# Altium schematic sheet 02_MCU_LCD.SchDoc
size A3; SheetNumber: 2; SheetTotal: 16
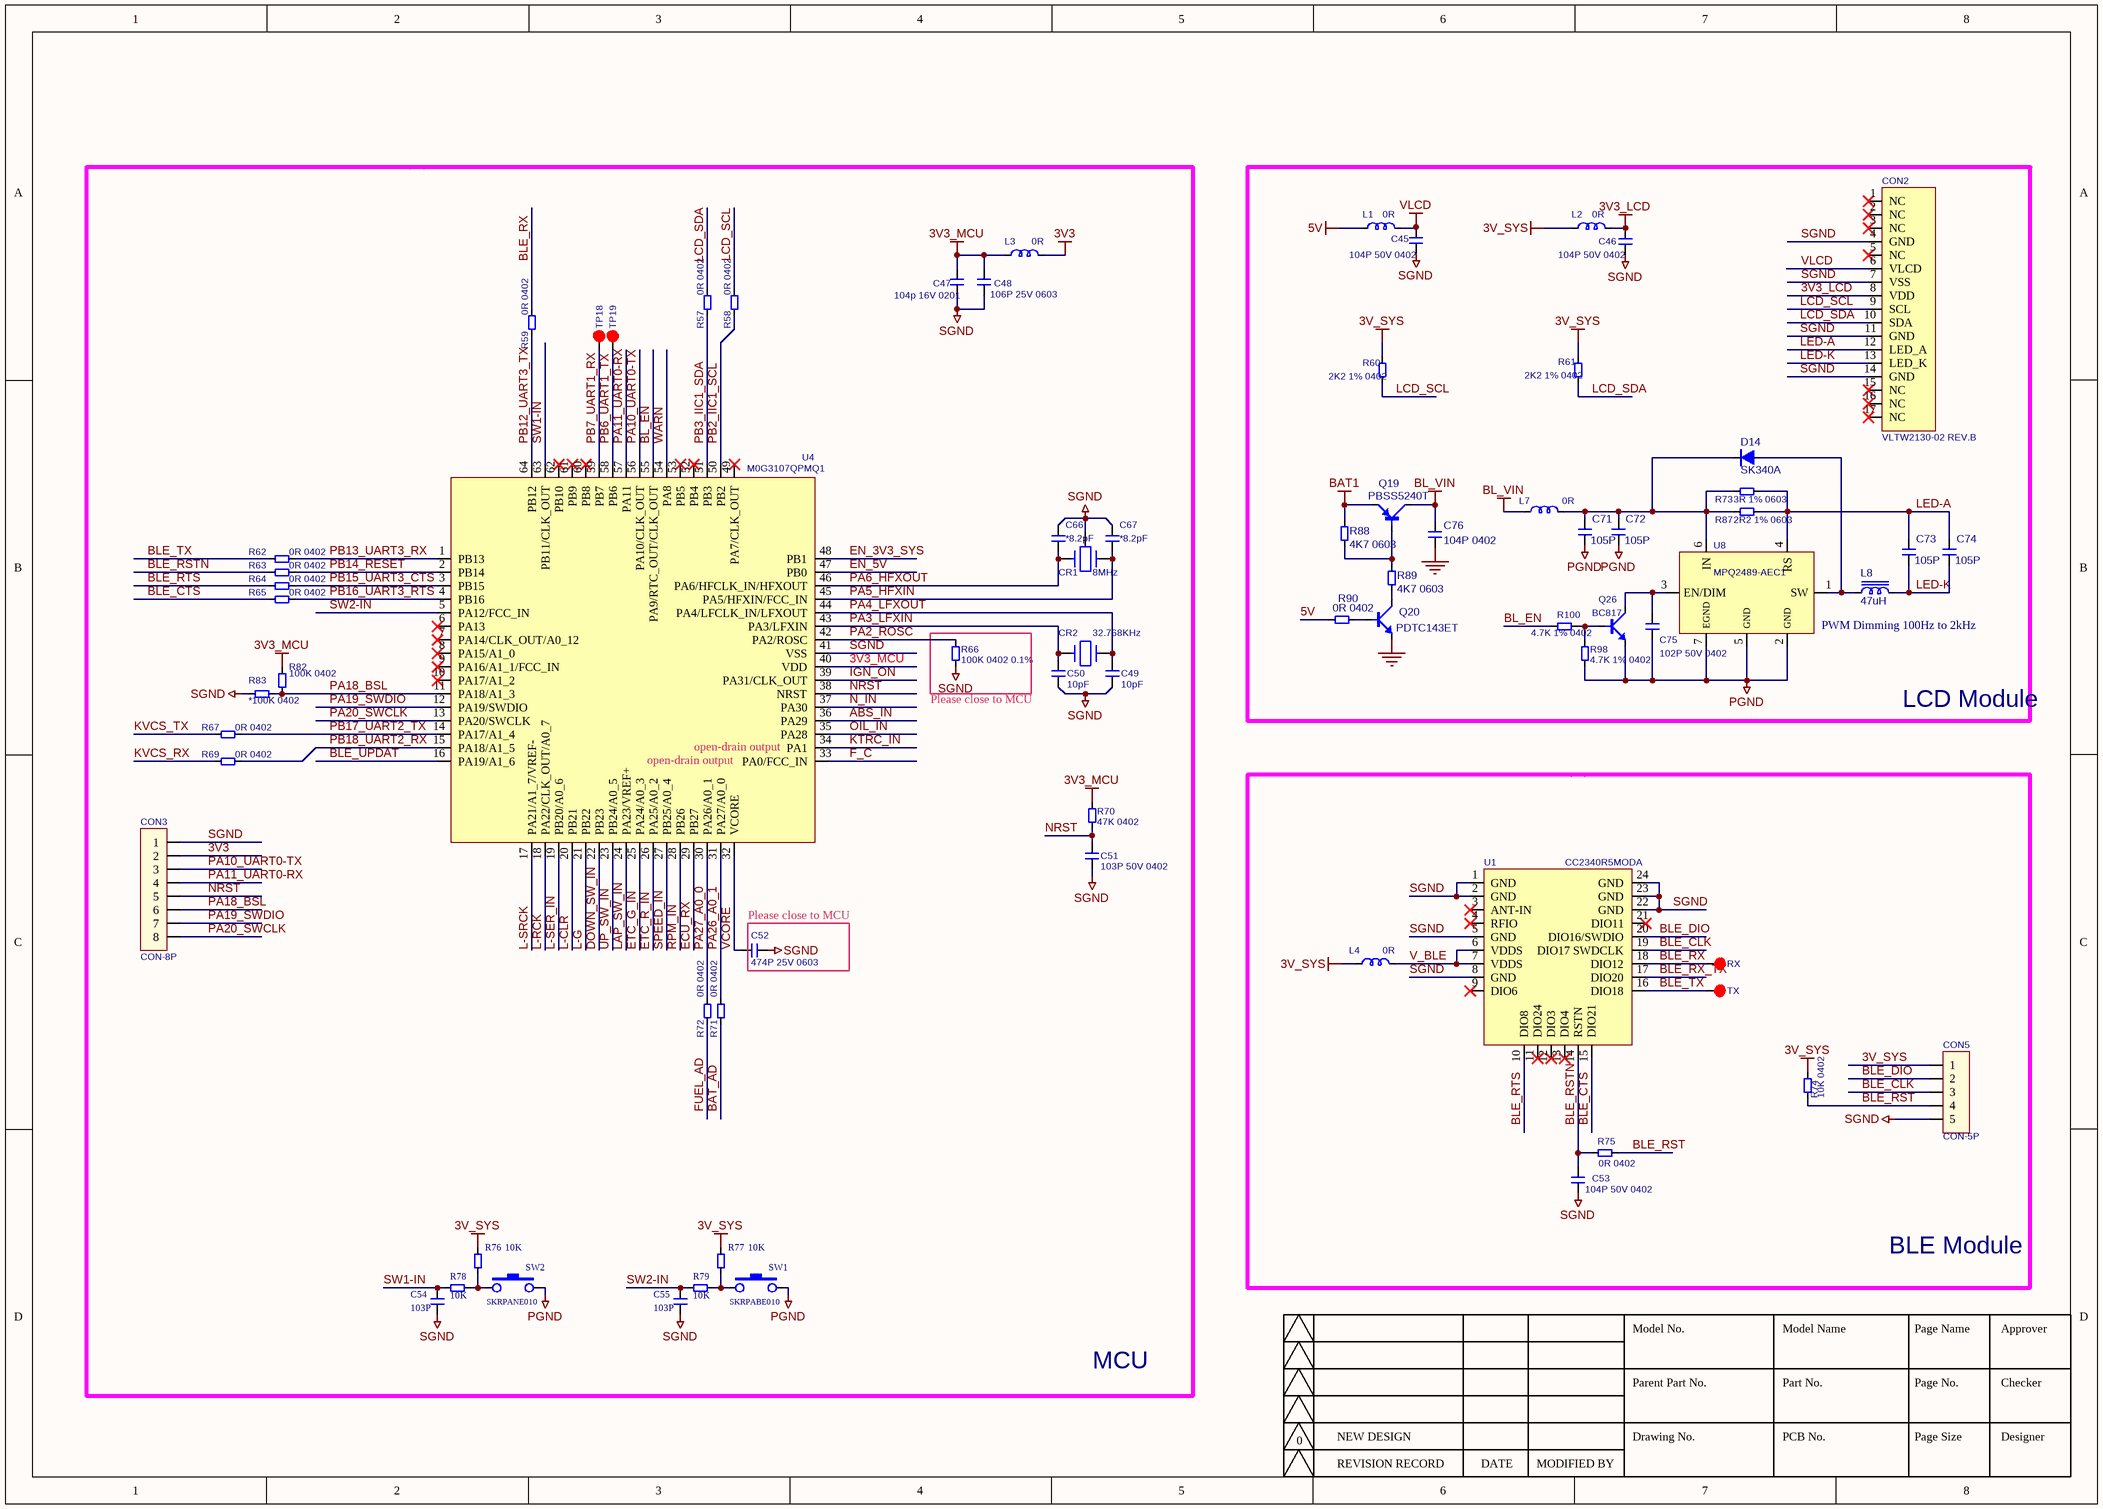
[diagram p0: 02_MCU_LCD.SchDoc]

## Parts
C45  104P 50V 0402  [C0402]
C46  104P 50V 0402  [C0402]
C47  104p 16V 0201  [C0201]
C48  106P 25V 0603  [C0603]
C49  10pF  [C0402]
C50  10pF  [C0402]
C51  103P 50V 0402  [C0402]
C52  474P 25V 0603  [C0603]
C53  104P 50V 0402  [C0402]
C54  103P  [C0402]
C55  103P  [C0402]
C66  *8.2pF  [C0402]
C67  *8.2pF  [C0402]
C71  105P  [C0603]
C72  105P  [C0603]
C73  105P  [C0603]
C74  105P  [C0603]
C75  102P 50V 0402  [C0402]
C76  104P 0402  [c0402]
CON2  VLTW2130-02 REV.B  [FPC-BL112-17P]
CON3  CON-8P  [CON-2.0(9021-N)-8P]
CON5  CON-5P  [CON-2.0V-5P]
CR1  8MHz  [CR-3CE]
CR2  32.768KHz  [CR-FC-13A]
D14  SK340A  [D-SMA]
L1  0R  [0603]
L2  0R  [0603]
L3  0R  [0603]
L4  0R  [0603]
L7  0R  [0603]
L8  47uH  [L-7.4X6.8]
Q19  PBSS5240T  [SOT23-RF]
Q20  PDTC143ET  [SOT23-RF]
Q26  BC817  [SOT323]
R57  0R 0402  [0402]
R58  0R 0402  [0402]
R59  0R 0402  [0402]
R60  2K2 1% 0402  [0402]
R61  2K2 1% 0402  [0402]
R62  0R 0402  [0402]
R63  0R 0402  [0402]
R64  0R 0402  [0402]
R65  0R 0402  [0402]
R66  100K 0402 0.1%  [0402]
R67  0R 0402  [0402]
R69  0R 0402  [0402]
R70  47K 0402  [0402]
R71  0R 0402  [0402]
R72  0R 0402  [0402]
R73  3R 1% 0603  [0603]
R74  10K 0402  [0402]
R75  0R 0402  [0402]
R76  10K  [0402]
R77  10K  [0402]
R78  10K  [0402]
R79  10K  [0402]
R82  100K 0402  [0402]
R83  *100K 0402  [0402]
R87  2R2 1% 0603  [0603]
R88  4K7 0603  [0603]
R89  4K7 0603  [0603]
R90  0R 0402  [0402]
R98  4.7K 1% 0402  [0402]
R100  4.7K 1% 0402  [0402]
RX  TEST  [TEST]  (value not drawn)  (no BOM)
SW1  SKRPABE010  [SW-SKRPABE010]
SW2  SKRPANE010  [SW-SKRPABE010]
TP18  TEST  [TEST]  (value not drawn)  (no BOM)
TP19  TEST  [TEST]  (value not drawn)  (no BOM)
TX  TEST  [TEST]  (value not drawn)  (no BOM)
U1  CC2340R5MODA  [IC-MOD-CC2340R5]
U4  M0G3107QPMQ1  [IC-M0G3107-64]
U8  MPQ2489-AEC1  [IC-QFN6-3X3]

## Blocks framed on the sheet
LCD Module: C45 C46 C71-C76 CON2 D14 L1 L2 L7 L8 Q19 Q20 Q26 R60 R61 R73 R87-R90 R98 R100 U8
Please close to MCU: C52

## Nets
3V3: CON3.2 L3.2
3V3_LCD: C46.1 CON2.8(VDD) L2.2
3V3_MCU: C47.1 C48.1 L3.1 R70.1 R82.1 U4.40(VDD)
3V_SYS: CON5.1 L2.1 L4.1 R60.2 R61.2 R74.2 R76.2 R77.2
5V: L1.1 R90.1
BAT1: Q19.3(E) R88.1
BL_VIN: C76.1 L7.1 Q19.2(C)
GND: C76.2 Q20.3(E)
PGND: C71.2 C72.2 C75.1 Q26.3(E) R98.2 SW1.2 SW2.2 U8.2(GND) U8.5(GND) U8.7(EGND)
SGND: C45.2 C46.2 C47.2 C48.2 C49.2 C50.2 C51.2 C52.2 C53.2 C54.2 C55.2 C66.2 C67.2 CON2.4(GND) CON2.7(VSS) CON2.11(GND) CON2.14(GND) CON3.1 CON5.5 CR1.3 R66.2 R83.2 U1.1(GND) U1.2(GND) U1.5(GND) U1.8(GND) U1.22(GND) U1.23(GND) U1.24(GND) U4.41(VSS)
VLCD: C45.1 CON2.6(VLCD) L1.2
ABS_IN: U4.36(PA29)
BAT_AD: R71.2
BL_EN: R100.2 U4.55(PA9/RTC_OUT/CLK_OUT)
BLE_CLK: CON5.3 U1.19(DIO17_SWDCLK)
BLE_CTS: R65.2 U1.15(DIO21)
BLE_DIO: CON5.2 U1.20(DIO16/SWDIO)
BLE_RST: CON5.4 R74.1 R75.2
BLE_RSTN: C53.1 R63.1 R75.1 U1.14(RSTN)
BLE_RTS: R64.2 U1.10(DIO8)
BLE_RX: R59.1 RX.TP U1.18(DIO12)
BLE_RX_TX: U1.17(DIO20)
BLE_TX: R62.2 TX.TP U1.16(DIO18)
BLE_UPDAT: U4.16(PA19/A1_6)
DOWN_SW_IN: U4.22(PB23)
ECU_RX: U4.29(PB27)
EN_3V3_SYS: U4.48(PB1)
EN_5V: U4.47(PB0)
ETC_G_IN: U4.25(PA24/A0_3)
ETC_R_IN: U4.26(PA25/A0_2)
F_C: U4.33(PA0/FCC_IN)
FUEL_AD: R72.2
IGN_ON: U4.39(PA31/CLK_OUT)
KTRC_IN: U4.34(PA1)
KVCS_RX: R69.1
KVCS_TX: R67.1
L-CLR: U4.20(PB21)
L-G: U4.21(PB22)
L-RCK: U4.18(PA22/CLK_OUT/A0_7)
L-SER_IN: U4.19(PB20/A0_6)
L-SRCK: U4.17(PA21/A1_7/VREF-)
LAP_SW_IN: U4.24(PA23/VREF+)
LCD_SCL: CON2.9(SCL) R58.2 R60.1
LCD_SDA: CON2.10(SDA) R57.2 R61.1
LED-A: C73.1 C74.1 CON2.12(LED_A) R73.1 R87.1 U8.4(RS)
LED-K: C73.2 C74.2 CON2.13(LED_K) L8.2
N_IN: U4.37(PA30)
NRST: C51.1 CON3.5 R70.2 U4.38(NRST)
OIL_IN: U4.35(PA28)
PA2_ROSC: R66.1 U4.42(PA2/ROSC)
PA3_LFXIN: C50.1 CR2.2 U4.43(PA3/LFXIN)
PA4_LFXOUT: C49.1 CR2.1 U4.44(PA4/LFCLK_IN/LFXOUT)
PA5_HFXIN: C67.1 CR1.2 U4.45(PA5/HFXIN/FCC_IN)
PA6_HFXOUT: C66.1 CR1.1 U4.46(PA6/HFCLK_IN/HFXOUT)
PA10_UART0-TX: CON3.3 U4.56(PA10/CLK_OUT)
PA11_UART0-RX: CON3.4 U4.57(PA11)
PA18_BSL: CON3.6 R82.2 R83.1 U4.11(PA18/A1_3)
PA19_SWDIO: CON3.7 U4.12(PA19/SWDIO)
PA20_SWCLK: CON3.8 U4.13(PA20/SWCLK)
PA26_A0_1: R71.1 U4.31(PA27/A0_0)
PA27_A0_0: R72.1 U4.30(PA26/A0_1)
PB2_IIC1_SCL: R58.1 U4.50(PB2)
PB3_IIC1_SDA: R57.1 U4.51(PB3)
PB6_UART1_TX: TP19.TP U4.58(PB6)
PB7_UART1_RX: TP18.TP U4.59(PB7)
PB12_UART3_TX: R59.2 U4.64(PB12)
PB13_UART3_RX: R62.1 U4.1(PB13)
PB14_RESET: R63.2 U4.2(PB14)
PB15_UART3_CTS: R64.1 U4.3(PB15)
PB16_UART3_RTS: R65.1 U4.4(PB16)
PB17_UART2_TX: R67.2 U4.14(PA17/A1_4)
PB18_UART2_RX: R69.2 U4.15(PA18/A1_5)
RPM_IN: U4.28(PB26)
SPEED_IN: U4.27(PB25/A0_4)
SW1-IN: C54.1 R78.2 U4.63(PB11/CLK_OUT)
SW2-IN: C55.1 R79.2 U4.5(PA12/FCC_IN)
UP_SW_IN: U4.23(PB24/A0_5)
V_BLE: L4.2 U1.6(VDDS) U1.7(VDDS)
VCORE: C52.1 U4.32(VCORE)
WARN: U4.54(PA8)
NetC71_1: C71.1 C72.1 D14.2(K) L7.2 R73.2 R87.2 U8.6(IN)
NetC75_2: C75.2 Q26.2(C) U8.3(EN/DIM)
NetD14_1: D14.1(A) L8.1 U8.1(SW)
NetQ19_1: Q19.1(B) R88.2 R89.1
NetQ20_1: Q20.1(B) R90.2
NetQ20_2: Q20.2(C) R89.2
NetQ26_1: Q26.1(B) R98.1 R100.1
NetR76_1: R76.1 R78.1 SW2.1
NetR77_1: R77.1 R79.1 SW1.1

Not connected (* = marked no-connect by the designer): CON2 1(NC)* 2(NC)* 3(NC)* 5(NC)* 15(NC)* 16(NC)* 17(NC)*; U1 3(ANT-IN)* 4(RFIO)* 9(DIO6)* 11(DIO24)* 12(DIO3)* 13(DIO4)* 21(DIO11)*; U4 6(PA13)* 7(PA14/CLK_OUT/A0_12)* 8(PA15/A1_0)* 9(PA16/A1_1/FCC_IN)* 10(PA17/A1_2)* 49(PA7/CLK_OUT)* 52(PB4)* 53(PB5)* 60(PB8)* 61(PB9)* 62(PB10)*

## Notes on the sheet
- (near U8) PWM Dimming 100Hz to 2kHz
- Please close to MCU
- (near U4) open-drain output
- BLE Module
- MCU
- Model No.
- Parent Part No.
- Part No.
- Model Name
- Page Name
- Page No.
- Approver
- Checker
- 0
- NEW DESIGN
- Drawing No.
- PCB No.
- Page Size
- Designer
- REVISION RECORD
- DATE
- MODIFIED BY

## Library data of the parts
C45 C46 C53 = C: Capacitor; z02-包裝or系列名稱: 0603，0805，1206，DIP; z01-耐壓or瓦特數: 16V，25V，50V，100V; z03-誤差: B，C，D，F，G，J，K，M，Z; z05-廠牌: MURATA，TDK; z04-參數: NPO，COG，X7R，Y5V; A-TOP: 104P 0402 X5R; 01-範例: 容值 耐壓 包裝 誤差 參數; z99-略1~101P: 50V 0603 J NP0(C0G) 廠牌; z99-略102P~104P↑: 50V 0603 K X7R  廠牌; z00-值or編碼: *P
C47 = C: Capacitor; z02-包裝or系列名稱: 0603，0805，1206，DIP; z01-耐壓or瓦特數: 16V，25V，50V，100V; z03-誤差: B，C，D，F，G，J，K，M，Z; z05-廠牌: MURATA，TDK; z04-參數: NPO，COG，X7R，Y5V; A-TOP: V31-A1104100; 01-範例: 容值 耐壓 包裝 誤差 參數; z99-略1~101P: 50V 0603 J NP0(C0G) 廠牌; z99-略102P~104P↑: 50V 0603 K X7R  廠牌; z00-值or編碼: *P
C48 = C: Capacitor; z02-包裝or系列名稱: 0603，0805，1206，DIP; z01-耐壓or瓦特數: 16V，25V，50V，100V; z03-誤差: B，C，D，F，G，J，K，M，Z; z05-廠牌: MURATA，TDK; z04-參數: NPO，COG，X7R，Y5V; A-TOP: V31-01106301; 01-範例: 容值 耐壓 包裝 誤差 參數; z99-略1~101P: 50V 0603 J NP0(C0G) 廠牌; z99-略102P~104P↑: 50V 0603 K X7R  廠牌; z00-值or編碼: *P
C49 C50 = C: Capacitor; z02-包裝or系列名稱: 0603，0805，1206，DIP; z01-耐壓or瓦特數: 16V，25V，50V，100V; z03-誤差: B，C，D，F，G，J，K，M，Z; z05-廠牌: MURATA，TDK; z04-參數: NPO，COG，X7R，Y5V; A-TOP: V31-A1100200; 01-範例: 容值 耐壓 包裝 誤差 參數; z99-略1~101P: 50V 0603 J NP0(C0G) 廠牌; z99-略102P~104P↑: 50V 0603 K X7R  廠牌; z00-值or編碼: *P
C51 = C: Capacitor; z02-包裝or系列名稱: 0603，0805，1206，DIP; z01-耐壓or瓦特數: 16V，25V，50V，100V; z03-誤差: B，C，D，F，G，J，K，M，Z; z05-廠牌: MURATA，TDK; z04-參數: NPO，COG，X7R，Y5V; A-TOP: V31-A1103200; 01-範例: 容值 耐壓 包裝 誤差 參數; z99-略1~101P: 50V 0603 J NP0(C0G) 廠牌; z99-略102P~104P↑: 50V 0603 K X7R  廠牌; z00-值or編碼: *P
C52 = C: Capacitor; z02-包裝or系列名稱: 0603，0805，1206，DIP; z01-耐壓or瓦特數: 16V，25V，50V，100V; z03-誤差: B，C，D，F，G，J，K，M，Z; z05-廠牌: MURATA，TDK; z04-參數: NPO，COG，X7R，Y5V; A-TOP: V31-47422; 01-範例: 容值 耐壓 包裝 誤差 參數; z99-略1~101P: 50V 0603 J NP0(C0G) 廠牌; z99-略102P~104P↑: 50V 0603 K X7R  廠牌; z00-值or編碼: *P
C54 C55 = C: Capacitor; z02-包裝or系列名稱: 0603，0805，1206，DIP; z01-耐壓or瓦特數: 16V，25V，50V，100V; z03-誤差: B，C，D，F，G，J，K，M，Z; z05-廠牌: MURATA，TDK; z04-參數: NPO，COG，X7R，Y5V; A-TOP: 103P 50V 0402 X7R AEC; 01-範例: 容值 耐壓 包裝 誤差 參數; z99-略1~101P: 50V 0603 J NP0(C0G) 廠牌; z99-略102P~104P↑: 50V 0603 K X7R  廠牌; z00-值or編碼: *P
C66 C67 = C: Capacitor; z02-包裝or系列名稱: 0603，0805，1206，DIP; z01-耐壓or瓦特數: 16V，25V，50V，100V; z03-誤差: B，C，D，F，G，J，K，M，Z; z05-廠牌: MURATA，TDK; z04-參數: NPO，COG，X7R，Y5V; A-TOP: 8.2pF 100V 0603 C0G; 01-範例: 容值 耐壓 包裝 誤差 參數; z99-略1~101P: 50V 0603 J NP0(C0G) 廠牌; z99-略102P~104P↑: 50V 0603 K X7R  廠牌; z00-值or編碼: *P
C71-C74 = C: Capacitor; z02-包裝or系列名稱: 0603，0805，1206，DIP; z01-耐壓or瓦特數: 16V，25V，50V，100V; z03-誤差: B，C，D，F，G，J，K，M，Z; z05-廠牌: MURATA，TDK; z04-參數: NPO，COG，X7R，Y5V; A-TOP: 105P 25V; 01-範例: 容值 耐壓 包裝 誤差 參數; z99-略1~101P: 50V 0603 J NP0(C0G) 廠牌; z99-略102P~104P↑: 50V 0603 K X7R  廠牌; z00-值or編碼: *P
C75 = C: Capacitor; z02-包裝or系列名稱: 0603，0805，1206，DIP; z01-耐壓or瓦特數: 16V，25V，50V，100V; z03-誤差: B，C，D，F，G，J，K，M，Z; z05-廠牌: MURATA，TDK; z04-參數: NPO，COG，X7R，Y5V; A-TOP: V31-A1102200; 01-範例: 容值 耐壓 包裝 誤差 參數; z99-略1~101P: 50V 0603 J NP0(C0G) 廠牌; z99-略102P~104P↑: 50V 0603 K X7R  廠牌; z00-值or編碼: *P
C76 = C: Capacitor; z02-包裝or系列名稱: 0603，0805，1206，DIP; z01-耐壓or瓦特數: 16V，25V，50V，100V; z03-誤差: B，C，D，F，G，J，K，M，Z; z05-廠牌: MURATA，TDK; z04-參數: NPO，COG，X7R，Y5V; A-TOP: V31-01104203; 01-範例: 容值 耐壓 包裝 誤差 參數; z99-略1~101P: 50V 0603 J NP0(C0G) 廠牌; z99-略102P~104P↑: 50V 0603 K X7R  廠牌; z00-值or編碼: *P
CON2 = VLTW2130-02 REV.B: A-TOP: 17P TF31
CON3 = CON-8P: A-TOP: NC
CON5 = CON-5P: 00-TOP: **; 01-範例: PIN數 系列 角度; z00-值or編碼: PIN數; z02-包裝or系列名稱: MX34，04040，04049; z09-客戶專用: LOCAL件=L，日本原廠件不標; z10-LCD: 若為LCD，則A-TOP填入該料號。
CR1 = CR-1: Crystal; A-TOP: V21-018M00G0; z00-值or編碼: 32768，4M，8M，12M，16M，20M; 01-範例: 振盪頻率HZ 包裝; z02-包裝or系列名稱: MC146／3CE／3CS／3CC; z04-參數: G55A(廉)，G15C99(貴)<8M才有分
CR2 = CR-2: Crystal; 01-範例: 振盪頻率HZ 包裝; A-TOP: V21-03FC13A0
D14 = D-SMD: BAS16/RR264/1N4148/FM4004/SS14/SSL14/V15PL50; z2-包裝: 2F，SOT23，SMA，SMB，SMC，LL34，SOD323，PMDU，SOD123，SOD123FL，SMPC; z0-編號: BAS16，BAV99，RR264，1N4148W，FM4004，SS14，SSL14，V15PL50; A-TOP: SK34A R3G; 01-範例: 編碼 包裝(SOT23略)
L1-L4 L7 = L: BEAD101; A-TOP: V02-01000030; z01-耐壓or瓦特數: 0603，; 01-範例: 編碼 包裝(0603略); z00-值or編碼: BEAD101; z02.1-包裝DIP: *; z02.2-SMD: *; z04-參數: *; z08-腳長or角度: *
L8 = L-1: A-TOP: V22-01M76470; z00-值or編碼: 220M，330M，680M; 01-範例: 系列名稱 值; z02-包裝or系列名稱: TDRH105R
Q19 = Q-PNP(BCE): BC807，2SA1812，PBSS9110T; 包裝: SOT23，SOT89; A-TOP: V12-15240; 01-範例: 編碼 包裝(SOT23略); 編號: BC807，2SA1812，PBSS9110T
Q20 = Q-NPN(BCE): BC817，PDTC143ET，2SD2211，2SD1918; 01-範例: 編號 包裝(SOT23略); z1-包裝: SOT23，SOT89，DPAK; A-TOP: PDTC143ET; z0-編號: BC817，PDTC143ET，2SD2211，2SD1918
Q26 = Q-NPN(BCE): BC817，PDTC143ET，2SD2211，2SD1918; z1-包裝: SOT23，SOT89，DPAK; A-TOP: NEW; 01-範例: 編號 包裝(SOT23略); z0-編號: BC817，PDTC143ET，2SD2211，2SD1918
R57-R59 R62 R64 R65 R67 R69 R71 R72 = R: z03-誤差: 1％; z05-廠牌: YAGEO，SYNTON，E-COM，WALSIN，EVER; 01-範例: V02-01010320; A-TOP: V02-01000020; z99-省略的部份: 0805 5% 廠牌; z02-包裝or系列名稱: 0603，1206，2010，2512，MECF200SS; z01-耐壓or瓦特數: Ｘ; z04-參數: Ｘ
R60 R61 = R: z02-包裝or系列名稱: 0603，1206，2010，2512，MECF200SS; z01-耐壓or瓦特數: Ｘ; z03-誤差: 1％; z05-廠牌: YAGEO，SYNTON，E-COM，WALSIN，EVER; 01-範例: 阻值 包裝(瓦特) 誤差; A-TOP: V02-A2022220; z99-省略的部份: 0805 5% 廠牌; z04-參數: Ｘ
R63 R75 = R-0603: 0603; z03-誤差: 1％; z05-廠牌: YAGEO，SYNTON，E-COM，WALSIN，EVER; 01-範例: 阻值 包裝(瓦特) 誤差; z99-省略的部份: 5% 廠牌; A-TOP: V02-01000020; z02-包裝or系列名稱: 0603
R66 R82 R83 = R-0603: 0603; z03-誤差: 1％; z05-廠牌: YAGEO，SYNTON，E-COM，WALSIN，EVER; 01-範例: 阻值 包裝(瓦特) 誤差; z99-省略的部份: 5% 廠牌; A-TOP: V02-02010420; z02-包裝or系列名稱: 0603
R70 = R-0603: 0603; z03-誤差: 1％; z05-廠牌: YAGEO，SYNTON，E-COM，WALSIN，EVER; 01-範例: 阻值 包裝(瓦特) 誤差; z99-省略的部份: 5% 廠牌; A-TOP: V02-02047320; z02-包裝or系列名稱: 0603
R73 = R: z03-誤差: 1％; z05-廠牌: YAGEO，SYNTON，E-COM，WALSIN，EVER; 01-範例: 阻值 包裝(瓦特) 誤差; A-TOP: V02-02003R30; z99-省略的部份: 0805 5% 廠牌; z02-包裝or系列名稱: 0603，1206，2010，2512，MECF200SS; z01-耐壓or瓦特數: Ｘ; z04-參數: Ｘ
R74 = R-0603: 0603; z03-誤差: 1％; z05-廠牌: YAGEO，SYNTON，E-COM，WALSIN，EVER; 01-範例: 阻值 包裝(瓦特) 誤差; z99-省略的部份: 5% 廠牌; A-TOP: V02-01010320; z02-包裝or系列名稱: 0603
R76-R79 = R-0603: 0603; z03-誤差: 1％; z05-廠牌: YAGEO，SYNTON，E-COM，WALSIN，EVER; 01-範例: 阻值 包裝(瓦特) 誤差; z99-省略的部份: 5% 廠牌; A-TOP: 10K 0402; z02-包裝or系列名稱: 0603
R87 = R: z03-誤差: 1％; z05-廠牌: YAGEO，SYNTON，E-COM，WALSIN，EVER; 01-範例: 阻值 包裝(瓦特) 誤差; A-TOP: V02-2R221; z99-省略的部份: 0805 5% 廠牌; z02-包裝or系列名稱: 0603，1206，2010，2512，MECF200SS; z01-耐壓or瓦特數: Ｘ; z04-參數: Ｘ
R88 R89 = R: z02-包裝or系列名稱: 0603，1206，2010，2512，MECF200SS; z01-耐壓or瓦特數: Ｘ; z03-誤差: 1％; z05-廠牌: YAGEO，SYNTON，E-COM，WALSIN，EVER; 01-範例: 阻值 包裝(瓦特) 誤差; A-TOP: 4K7 5% 0603 國; z99-省略的部份: 0805 5% 廠牌; z04-參數: Ｘ
R90 = R-0603: 0603; z03-誤差: 1％; z05-廠牌: YAGEO，SYNTON，E-COM，WALSIN，EVER; 01-範例: 阻值 包裝(瓦特) 誤差; z99-省略的部份: 5% 廠牌; A-TOP: V02-01000021; z02-包裝or系列名稱: 0603
R98 R100 = R: z03-誤差: 1％; z05-廠牌: YAGEO，SYNTON，E-COM，WALSIN，EVER; 01-範例: 阻值 包裝(瓦特) 誤差; A-TOP: V02-02047220; z99-省略的部份: 0805 5% 廠牌; z02-包裝or系列名稱: 0603，1206，2010，2512，MECF200SS; z01-耐壓or瓦特數: Ｘ; z04-參數: Ｘ
SW1 = SW-PB: z02-包裝or系列名稱: 1102W8，1102W9，1109S，TSXH-2GL，DIP1102; z04-參數or荷重: 100G，160G，250G，520G; A-TOP: V20-01BE0100; 01-範例: 包裝 H高度 荷重; z07-大小or高度: H：3-8，7，9-5，13，15
SW2 = SW-PB: z02-包裝or系列名稱: 1102W8，1102W9，1109S，TSXH-2GL，DIP1102; z04-參數or荷重: 100G，160G，250G，520G; 01-範例: 包裝 H高度 荷重; z07-大小or高度: H：3-8，7，9-5，13，15; A-TOP: SKRPANE010
U1 = CC234055MODA: A-TOP: NEW
U4 = M0G3107QPMQ1: A-TOP: NEW